# EAGLE design MotorEncoder (EAGLE 9.0.1)
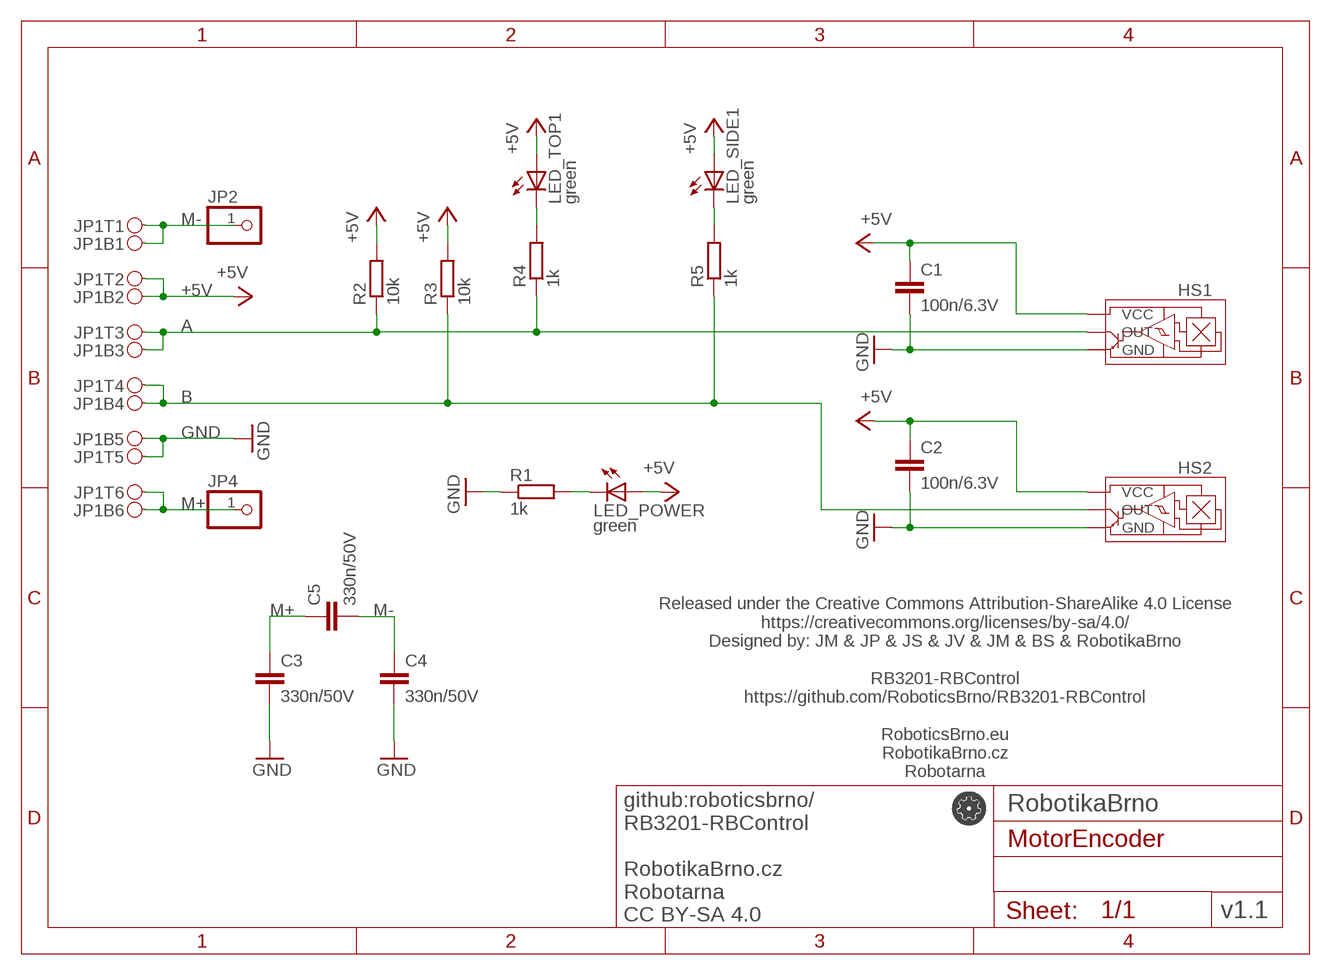
[diagram p0: schematic, sheet 1]

## Parts
C1  100n/6.3V  C-EUC0402  [C0402]
C2  100n/6.3V  C-EUC0402  [C0402]
C3  330n/50V  C-EUC0805  [C0805]
C4  330n/50V  C-EUC0805  [C0805]
C5  330n/50V  C-EUC0805  [C0805]
HS1  HALL  [SMD/TH]
HS2  HALL  [SMD/TH]
JP1  PINH2X06  [PINH2X06SMD]
JP2  PINHD-1X1  [1X01]
JP4  PINHD-1X1  [1X01]
LED_POWER  green  LEDCHIPLED_0603  [CHIPLED_0603]
LED_SIDE1  green  LEDCHIPLED_0603  [CHIPLED_0603]
LED_TOP1  green  LEDCHIPLED_0603  [CHIPLED_0603]
R1  1k  R-EU_R0603  [R0603]
R2  10k  R-EU_R0603  [R0603]
R3  10k  R-EU_R0603  [R0603]
R4  1k  R-EU_R0603  [R0603]
R5  1k  R-EU_R0603  [R0603]

## Nets
+5V: C1.1 C2.1 HS1.VCC HS2.VCC JP1.B2 JP1.T2 LED_POWER.A LED_SIDE1.A LED_TOP1.A R2.2 R3.2
A: HS1.OUT JP1.B3 JP1.T3 R2.1 R4.1
B: HS2.OUT JP1.B4 JP1.T4 R3.1 R5.1
GND: C1.2 C2.2 C3.2 C4.2 HS1.GND HS2.GND JP1.B5 JP1.T5 R1.1
LED_POWER: LED_POWER.C R1.2
LED_SIDE1: LED_SIDE1.C R5.2
LED_TOP1: LED_TOP1.C R4.2
M+: C3.1 C5.1 JP1.B6 JP1.T6 JP4.1
M-: C4.1 C5.2 JP1.B1 JP1.T1 JP2.1

## Notes on the sheet
- Released under the Creative Commons Attribution-ShareAlike 4.0 License
  https://creativecommons.org/licenses/by-sa/4.0/
  Designed by: JM & JP & JS & JV & JM & BS & RobotikaBrno
  
  RB3201-RBControl
  https://github.com/RoboticsBrno/RB3201-RBControl
  
  RoboticsBrno.eu
  RobotikaBrno.cz
  Robotarna
- RobotikaBrno
- v1.1
- github:roboticsbrno/
  RB3201-RBControl
  
  RobotikaBrno.cz
  Robotarna
  CC BY-SA 4.0

## Library data of the parts
C1-C5 = rcl:C-EU: CAPACITOR, European symbol; SPICEPREFIX: C
HS1 HS2 = HallSensor:HALL
JP1 = pinhead_smd:PINH2X06
JP2 JP4 = pinhead:PINHD-1X1: PIN HEADER
LED_POWER LED_SIDE1 LED_TOP1 = led:LED: LED OSRAM: - CHIPLED LG R971, LG N971, LY N971, LG Q971, LY Q971, LO R971, LY R971 LH N974, LH R974 LS Q976, LO Q976, LY Q976 LO Q996 - Hyper CHIPLED LW Q18S LB Q993, LB Q99A, LB R99A - SideLED LS A670, LO A670, LY A670, LG A670, LP A670 LB A673, LV A673, LT A673, LW A673 LH A674 LY A675 LS A676, LA A676, LO A676, LY A676, LW A676 LS A679, LY A679, LG A679 - Hyper Micro SIDELED® LS Y876, LA Y876, LO Y876, LY Y876 LT Y87S - SmartLED LW L88C, LW L88S LB L89C, LB L89S, LG L890 LS L89K, LO L89K, LY L89K LS L896, LA L896, LO L896, LY L896 - TOPLED LS T670, LO T670, LY T670, LG T670, LP T670 LSG T670, LSP T670, LSY T670, LOP T670, LYG T670 LG T671, LOG T671, LSG T671 LB T673, LV T673, LT T673, LW T673 LH T674 LS T676, LA T676, LO T676, LY T676, LB T676, LH T676, LSB T676, LW T676 LB T67C, LV T67C, LT T67C, LS T67K, LO T67K, LY T67K, LW E67C LS E67B, LA E67B, LO E67B, LY E67B, LB E67C, LV E67C, LT E67C LW T67C LS T679, LY T679, LG T679 LS T770, LO T770, LY T770, LG T770, LP T770 LB T773, LV T773, LT T773, LW T773 LH T774 LS E675, LA E675, LY E675, LS T675 LS T776, LA T776, LO T776, LY T776, LB T776 LHGB T686 LT T68C, LB T68C - Hyper Mini TOPLED® LB M676 - Mini TOPLED Santana® LG M470 LS M47K, LO M47K, LY M47K Source: http://www.osram.convergy.de LUXEON: - LUMILED® LXK2-PW12-R00, LXK2-PW12-S00, LXK2-PW14-U00, LXK2-PW14-V00 LXK2-PM12-R00, LXK2-PM12-S00, LXK2-PM14-U00 LXK2-PE12-Q00, LXK2-PE12-R00, LXK2-PE12-S00, LXK2-PE14-T00, LXK2-PE14-U00 LXK2-PB12-K00, LXK2-PB12-L00, LXK2-PB12-M00, LXK2-PB14-N00, LXK2-PB14-P00, LXK2-PB14-Q00 LXK2-PR12-L00, LXK2-PR12-M00, LXK2-PR14-Q00, LXK2-PR14-R00 LXK2-PD12-Q00, LXK2-PD12-R00, LXK2-PD12-S00 LXK2-PH12-R00, LXK2-PH12-S00 LXK2-PL12-P00, LXK2-PL12-Q00, LXK2-PL12-R00 Source: www.luxeon.com KINGBRIGHT: KA-3528ASYC Source: www.kingbright.com; DIGIKEY: 160-1446-1-ND; FARNELL: 2293494; MOUSER: 859-LTST-C191KGKT; RS: 872-1799
R1-R5 = rcl:R-EU_: RESISTOR, European symbol; SPICEPREFIX: R

## Board
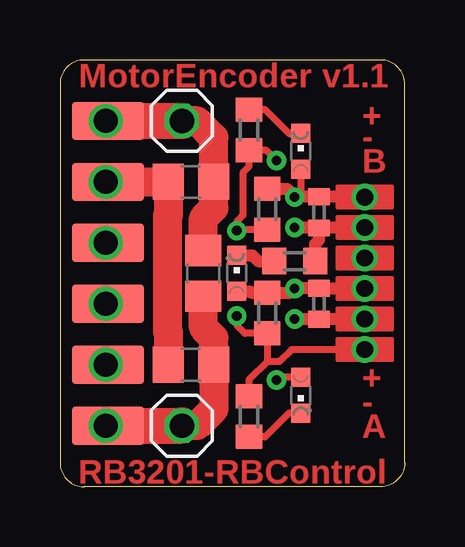
[diagram p1: board, top side]
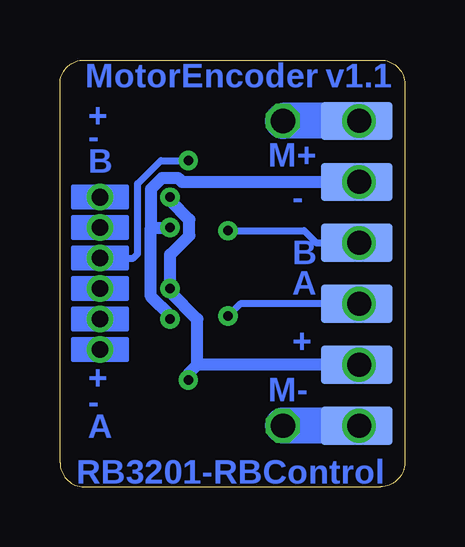
[diagram p2: board, bottom side, seen from below]

Size 14.37 x 17.78 mm. Coordinates in mm from the lower left corner, seen from the top.
Outline: 13.37,17.78 1,17.78 arc90 0,16.78 0,1 arc90 1,0 13.37,0 arc90 14.37,1 14.37,16.78 arc90 13.37,17.78
Copper layers (1*16): Top 0.035mm / dielectric 1.5mm / Bottom 0.035mm
Design rules "gatema_2layers": minimum track width 0.15mm, minimum drill 0.3mm, track to track 0.15mm, track to pad 0.15mm, pad to pad 0.15mm, via to via 0.15mm, smd to smd 0mil, copper to edge 0.15mm, drill to drill 0.4mm, minimum pad ring 0.2mm, minimum via ring 0.2mm, stop-mask expansion 2mil, vias tented up to drill 0.4mm, thermal gap 10mil

### Footprints (pad centres in the part's own frame; a part is rotated, then mirrored left to right if it is on the bottom)
C0402 = smd 0.7 x 0.9: 1 -0.65,0; 2 0.65,0
C0805 = smd 1.3 x 1.5: 1 -0.95,0; 2 0.95,0
SMD/TH = drill 0.7: GND 0,0; OUT 0,-1.27; VCC 0,1.27
PINH2X06SMD = smd 1.6 x 3 bottom: B1 -6.35,-2; B2 -3.81,-2; B3 -1.27,-2; B4 1.27,-2; B5 3.81,-2; B6 6.35,-2 | smd 1.6 x 3: T1 -6.35,-2; T2 -3.81,-2; T3 -1.27,-2; T4 1.27,-2; T5 3.81,-2; T6 6.35,-2
1X01 = drill 1.016 octagon: 1 0,0
CHIPLED_0603 = smd 0.8 x 0.8: A 0,-0.75; C 0,0.75
R0603 = smd 1 x 1.1: 1 -0.85,0; 2 0.85,0

### Placement (x,y rotation side)
C1  10.79,7.62 270 top
C2  10.79,11.43 270 top
C3  5.46,12.7 180 top
C4  5.46,5.08 180 top
C5  5.97,8.89 270 top
HS1  12.7,6.99 0 top
HS2  12.7,10.79 0 top
JP1  0,8.89 90 top
JP2  5.08,2.54 0 top
JP4  5.08,15.24 0 top
LED_POWER  7.37,8.89 0 top
LED_SIDE1  10.03,13.97 0 top
LED_TOP1  10.03,3.81 180 top
R1  9.78,9.4 180 top
R2  8.64,7.24 90 top
R3  8.64,11.56 90 top
R4  7.87,2.92 270 top
R5  7.87,14.86 90 top

### Tracks (layer width: path | path; a pad name or v marks a point on that pad's centre or on a via)
+5V  (via drill 0.4, 1)
  Top 0.3: LED_SIDE1.A 10.03,12.32 9.79,12.08 | LED_TOP1.A 9.13,4.56 v9.02,4.45 | JP1.T2 v1.91,5.08
  Top 0.5: HS2.VCC 12.69,12.08 C2.1 9.79,12.08 | 9.79,12.08 v9.78,12.06 | R3.2 9.47,12.41 9.79,12.08 | HS1.VCC 10.81,8.26 C1.1 9.79,8.27 | 9.79,8.27 v9.78,8.26 | 9.79,8.27 9.61,8.09 R2.2 7.96,8.09 7.91,8.14 LED_POWER.A
  Bottom 0.3: JP1.T2 v1.91,5.08
  Bottom 0.5: 8.64,5.08 9.02,4.7 v9.02,4.45 | JP1.T2 8.64,5.08 | 8.64,5.08 8.64,6.99 9.78,8.13 | 9.78,8.13 9.78,9.66 8.98,10.46 8.98,11.13 9.78,11.93 v9.78,12.06 | v9.78,8.26 9.78,8.13
A  (via drill 0.4, 1)
  Top 0.3: HS1.OUT 9.65,5.71 9.14,5.21 8.64,5.21 | 8.64,5.21 7.87,4.45 R4.1 | 8.64,5.21 R2.1 7.71,6.39 7.37,6.73 v7.37,7.11 | JP1.B3 v1.91,7.62
  Bottom 0.3: v7.37,7.11 6.86,7.62 JP1.B3 v1.91,7.62
B  (via drill 0.4, 1)
  Top 0.3: R3.1 7.41,10.71 | 7.41,10.71 v7.37,10.67 | 7.41,10.71 7.41,11.09 7.62,11.3 7.62,13.08 7.87,13.34 R5.1 8.6,14.01 v9.02,13.59 | JP1.T4 v1.91,10.16
  Bottom 0.3: v7.37,10.67 4.19,10.67 3.68,10.16 v1.91,10.16 JP1.T4 | HS2.OUT 11.3,9.53 11.13,9.7 11.13,12.62 10.16,13.59 v9.02,13.59
GND  (via drill 0.4, 1)
  Top 0.3: JP1.T5 v1.91,12.7
  Top 0.5: HS2.GND 10.81,10.79 C2.2 | C2.2 9.79,10.78 v9.78,10.79 | HS1.GND 10.81,6.99 C1.2 9.79,6.97 v9.78,6.99 | R1.1 10.63,10.12 | 10.63,10.12 10.67,10.16 | 10.63,10.12 10.79,10.29 C2.2
  Top 1.2: JP1.T5 C3.2 4.51,11.35 4.47,11.31 4.47,6.47 4.51,6.43 C4.2
  Bottom 0.3: JP1.T5 v1.91,12.7
  Bottom 0.5: v9.78,6.99 9.78,7.12 10.58,7.92 10.58,10.79 | v1.91,12.7 9.28,12.7 9.45,12.87 10.11,12.87 10.58,12.4 10.58,10.79 | 10.58,10.79 v9.78,10.79
LED_POWER
  Top 0.5: LED_POWER.C 8.01,9.64 8.26,9.4 R1.2
LED_SIDE1
  Top 0.3: LED_SIDE1.C 9.54,14.72 8.55,15.71 R5.2
LED_TOP1
  Top 0.3: LED_TOP1.C 9.54,3.06 8.55,2.07 R4.2
M+  (via drill 1)
  Top 1.2: JP4.1 5.71,15.24 6.41,14.54 C3.1 6.41,11.62 5.97,11.18 C5.1
  Top 1.5: JP1.T6 JP4.1
  Bottom 0.5: JP1.T6 v1.91,15.24
  Bottom 1.5: JP1.T6 JP4.1
M-  (via drill 1)
  Top 1.2: JP2.1 5.71,2.54 6.41,3.24 C4.1 6.41,6.18 5.97,6.63 C5.2
  Top 1.5: JP1.B1 JP2.1
  Bottom 0.5: JP1.B1 v1.91,2.54
  Bottom 1.5: JP1.B1 JP2.1

### Text on the board
Top: MotorEncoder | v1.1 | + | - | B | + | - | A | RB3201-RBControl
Bottom: v1.1 | MotorEncoder | + | - | M+ | B | - | B | A | + | M- | + | - | A | RB3201-RBControl
tDocu: MotorEncoder | v1.1 | + | - | B | M+ | - | B | A | + | M- | + | - | A | RB3201-RBControl
bDocu: v1.1 | MotorEncoder | + | - | M+ | B | - | B | A | + | M- | + | - | A | RB3201-RBControl